# EAGLE design caretaker-dimmer-mini (EAGLE 5.10)
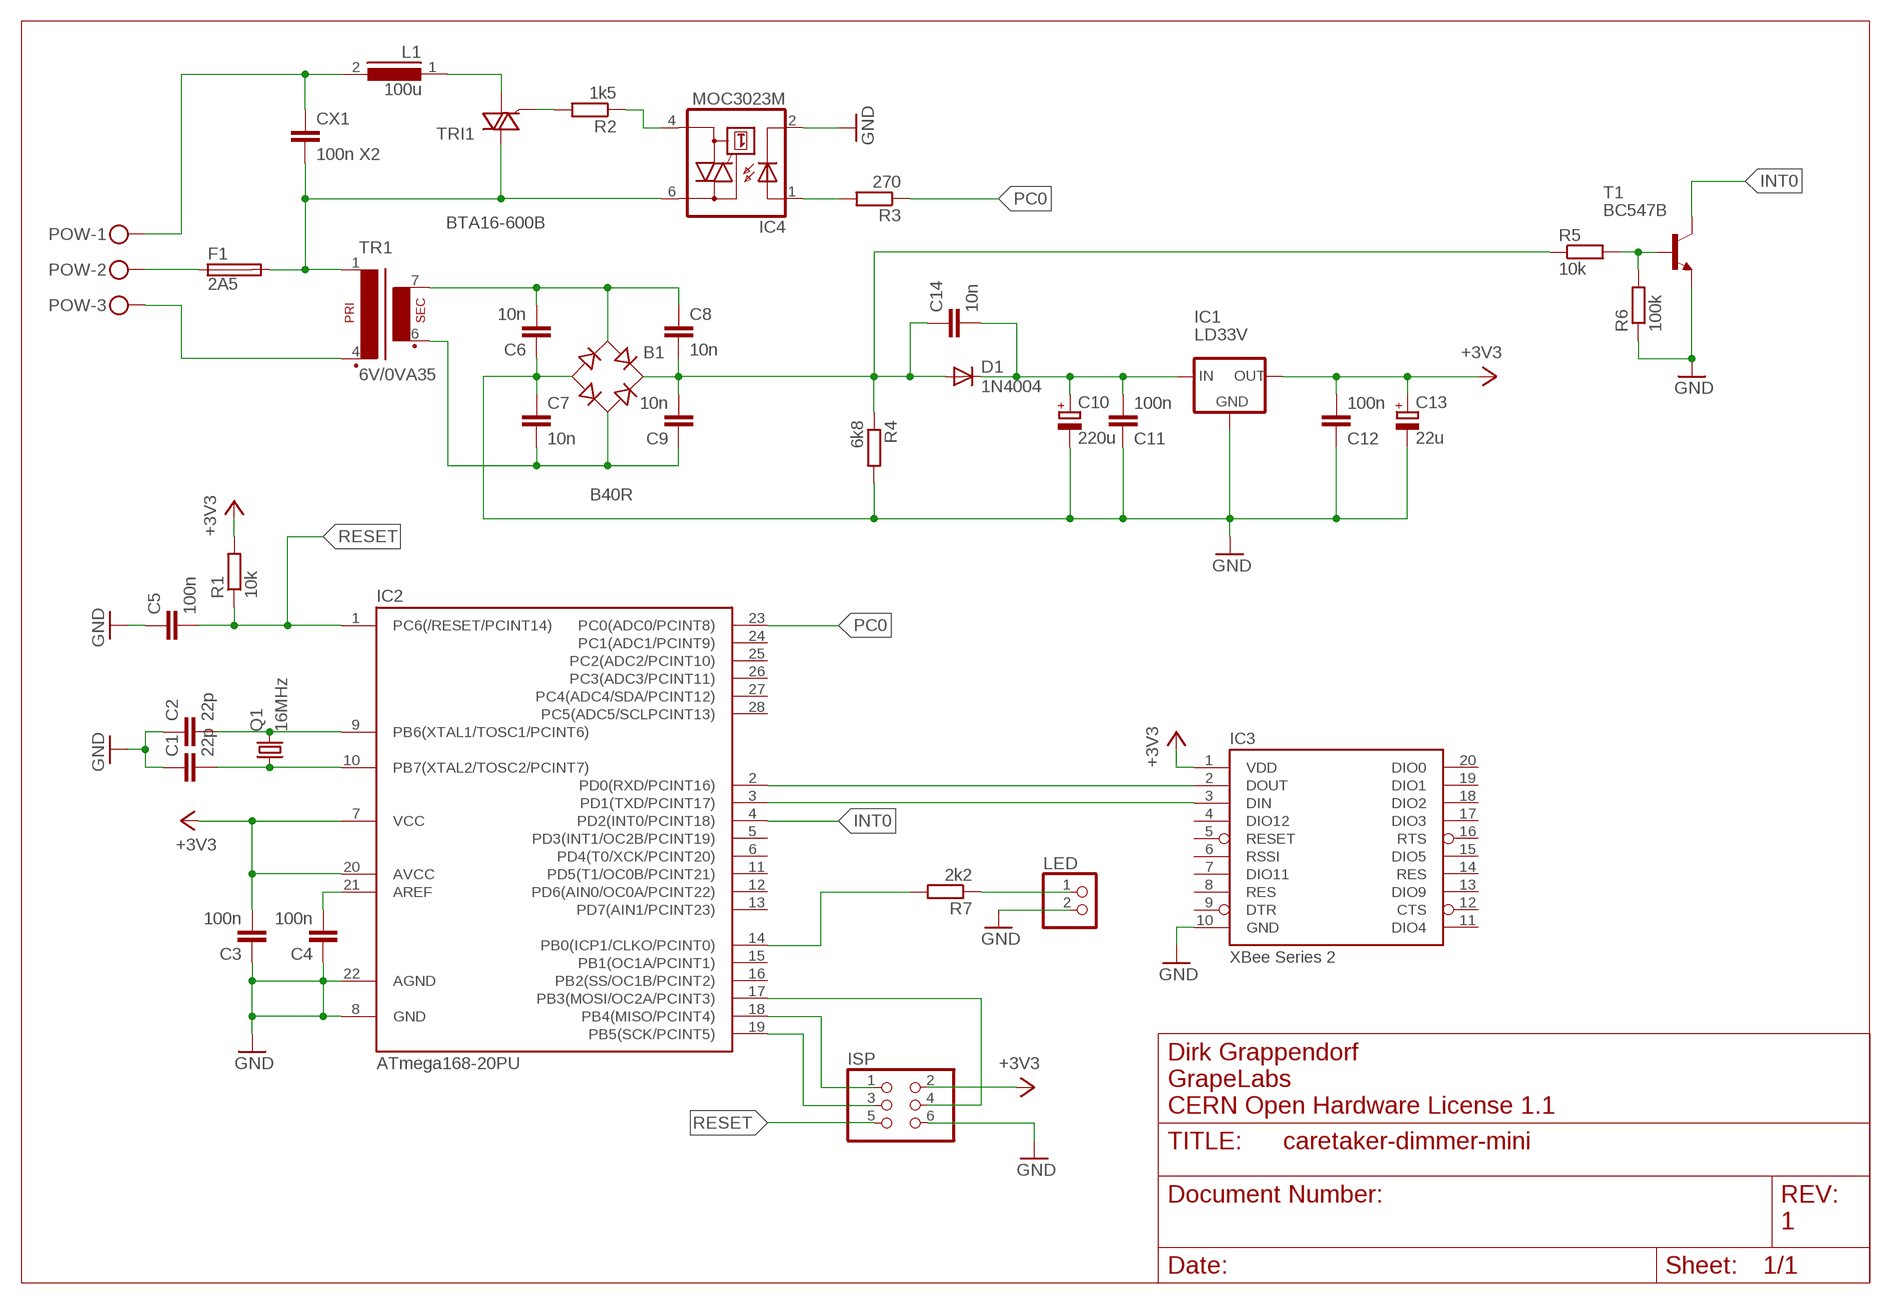
[diagram p0: schematic, sheet 1]

## Parts
B1  B40R  RECTIFIER-RB1A  [RB1A]
C1  22p  C-EU025-025X050  [C025-025X050]
C2  22p  C-EU025-025X050  [C025-025X050]
C3  100n  C-EU025-024X044  [C025-024X044]
C4  100n  C-EU025-024X044  [C025-024X044]
C5  100n  C-EU025-024X044  [C025-024X044]
C6  10n  C-EU025-024X044  [C025-024X044]
C7  10n  C-EU025-024X044  [C025-024X044]
C8  10n  C-EU025-024X044  [C025-024X044]
C9  10n  C-EU025-024X044  [C025-024X044]
C10  220u  CPOL-EUE3.5-8  [E3,5-8]
C11  100n  C-EU025-024X044  [C025-024X044]
C12  100n  C-EU025-024X044  [C025-024X044]
C13  22u  CPOL-EUE2.5-5  [E2,5-5]
C14  10n  C-EU025-024X044  [C025-024X044]
CX1  100n X2  CXXC15B10  [XC15B10]
D1  1N4004  DIODE-C1702-05  [C1702-05]
F1  2A5  SH22,5  [SH22,5]
IC1  LD33V  V_REG_LD1117VXX  [78XXL]
IC2  ATmega168-20PU  ATMEGA48/88/168-PU  [DIL28-3]
IC3  XBee Series 2  XBEE-1B1  [XBEE-1]
IC4  MOC3023M  [DIL06]
ISP  PINHD-2X3  [2X03]
L1  100u  ED22  [ED22]
LED  PINHD-1X2  [1X02]
POW  MKDSN1,5/3-5,08  [MKDSN1,5/3-5,08]
Q1  16MHz  CRYSTALHC49U-V  [HC49U-V]
R1  10k  R-EU_0204/7  [0204/7]
R2  1k5  R-EU_0204/7  [0204/7]
R3  270  R-EU_0207/2V  [0207/2V]
R4  6k8  R-EU_0207/2V  [0207/2V]
R5  10k  R-EU_0207/2V  [0207/2V]
R6  100k  R-EU_0207/2V  [0207/2V]
R7  2k2  R-EU_0207/2V  [0207/2V]
T1  BC547B  [TO92]
TR1  6V/0VA35  TRAFO-6V  [TRAFO-6V]
TRI1  BTA16-600B  BT136  [TO220AB]

## Nets
+3V3: C3.2 C12.2 C13.+ IC1.GND(OUT) IC2.7(VCC) IC2.20(AVCC) IC3.1(VDD) ISP.2 R1.2
GND: B1.- C1.1 C2.1 C3.1 C4.1 C5.1 C6.1 C7.1 C10.- C11.1 C12.1 C13.- IC1.IN(GND) IC2.8(GND) IC2.22(AGND) IC3.10(GND) IC4.2(C) ISP.6 LED.2 R4.2 R6.1 T1.1(E)
INT0: IC2.4(PD2(INT0/PCINT18)) T1.3(C)
N$1: C2.2 IC2.9(PB6(XTAL1/TOSC1/PCINT6)) Q1.2
N$2: C1.2 IC2.10(PB7(XTAL2/TOSC2/PCINT7)) Q1.1
N$3: C4.2 IC2.21(AREF)
N$4: LED.1 R7.1
N$5: B1.AC1 C6.2 C8.1 TR1.7(S4)
N$6: R2.2 TRI1.3(G)
N$7: C10.+ C11.2 C14.2 D1.C IC1.OUT(IN)
N$8: B1.AC2 C7.2 C9.1 TR1.6(S3)
N$9: CX1.1 L1.2 POW.1
N$10: F1.1 POW.2
N$11: L1.1 TRI1.1(A1)
N$12: CX1.2 F1.2 IC4.6(A2) TR1.1 TRI1.2(A2)
N$13: POW.3 TR1.4(P2)
N$14: IC4.4(A1) R2.1
N$15: IC4.1(A) R3.2
N$16: IC2.2(PD0(RXD/PCINT16)) IC3.2(DOUT)
N$17: IC2.3(PD1(TXD/PCINT17)) IC3.3(DIN)
N$18: B1.+ C8.2 C9.2 C14.1 D1.A R4.1 R5.1
N$19: R5.2 R6.2 T1.2(B)
N$20: IC2.18(PB4(MISO/PCINT4)) ISP.1
N$21: IC2.19(PB5(SCK/PCINT5)) ISP.3
N$22: IC2.17(PB3(MOSI/OC2A/PCINT3)) ISP.4
N$23: IC2.14(PB0(ICP1/CLKO/PCINT0)) R7.2
PC0: IC2.23(PC0(ADC0/PCINT8)) R3.1
RESET: C5.2 IC2.1(PC6(/RESET/PCINT14)) ISP.5 R1.1
Unconnected: IC2.5(PD3(INT1/OC2B/PCINT19)) IC2.6(PD4(T0/XCK/PCINT20)) IC2.11(PD5(T1/OC0B/PCINT21)) IC2.12(PD6(AIN0/OC0A/PCINT22)) IC2.13(PD7(AIN1/PCINT23)) IC2.15(PB1(OC1A/PCINT1)) IC2.16(PB2(SS/OC1B/PCINT2)) IC2.24(PC1(ADC1/PCINT9)) IC2.25(PC2(ADC2/PCINT10)) IC2.26(PC3(ADC3/PCINT11)) IC2.27(PC4(ADC4/SDA/PCINT12)) IC2.28(PC5(ADC5/SCLPCINT13)) IC3.4(DIO12) IC3.5(RESET) IC3.6(RSSI) IC3.7(DIO11) IC3.8(RES) IC3.9(DTR) IC3.11(DIO4) IC3.12(CTS) IC3.13(DIO9) IC3.14(RES) IC3.15(DIO5) IC3.16(RTS) IC3.17(DIO3) IC3.18(DIO2) IC3.19(DIO1) IC3.20(DIO0)

## Notes on the sheet
- Dirk Grappendorf
- GrapeLabs
- CERN Open Hardware License 1.1
- 1

## Library data of the parts
B1 = rectifier:RECTIFIER-: Rectifier
C1-C9 C11 C12 C14 = rcl:C-EU: CAPACITOR, European symbol
C10 C13 = rcl:CPOL-EU: POLARIZED CAPACITOR, European symbol
CX1 = rcl:CX: X CAPACITOR for power line
D1 = diode:DIODE-: DIODE
F1 = fuse:SH22,5: FUSE HOLDER grid 22,5 mm, OGN0031 8201, Schurter (Buerklin)
IC1 = SparkFun:V_REG_LD1117VXX: LD1117VXX voltage regulator. We carry the 3.3V version (COM-00526) in TO-220 package.
IC2 = atmega8:ATMEGA48/88/168-PU
IC3 = SparkFun:XBEE-1
IC4 = optocoupler:MOC30*M: RANDOM-PHASE OPTOISOLATORS TRIAC DRIVER OUTPUT Source: http://www.fairchildsemi.com MOC3020-M.pdf
ISP = pinhead:PINHD-2X3: PIN HEADER
L1 = inductors:ED22: INDUCTOR
LED = pinhead:PINHD-1X2: PIN HEADER
POW = con-phoenix-508:MKDSN1,5/3-5,08: MKDSN 1,5/ 3-5,08 Printklemme Nennstrom: 13,5 A Nennspannung: 250 V Rastermaß: 5,08 mm Polzahl: 3 Anschlussart: Schraubanschluss Montage: Löten Anschlussrichtung Leiter/Platine: 0 ° Artikelnummer: 1729131 Source: http://eshop.phoenixcontact.com .. 1729131.pdf
Q1 = crystal:CRYSTAL: CRYSTAL
R1-R7 = rcl:R-EU_: RESISTOR, European symbol
T1 = transistor-npn:BC547*: NPN Transistor
TR1 = grapelabs:TRAFO-6V: TRANSFORMER 1 primary winding, 1 secondary winding BLOCK
TRI1 = triac:BT136: Triac BT136 series E sensitive gate Source: http://www.nxp.com/acrobat_download/datasheets/BT136_SERIES_E_2.pdf

## Board
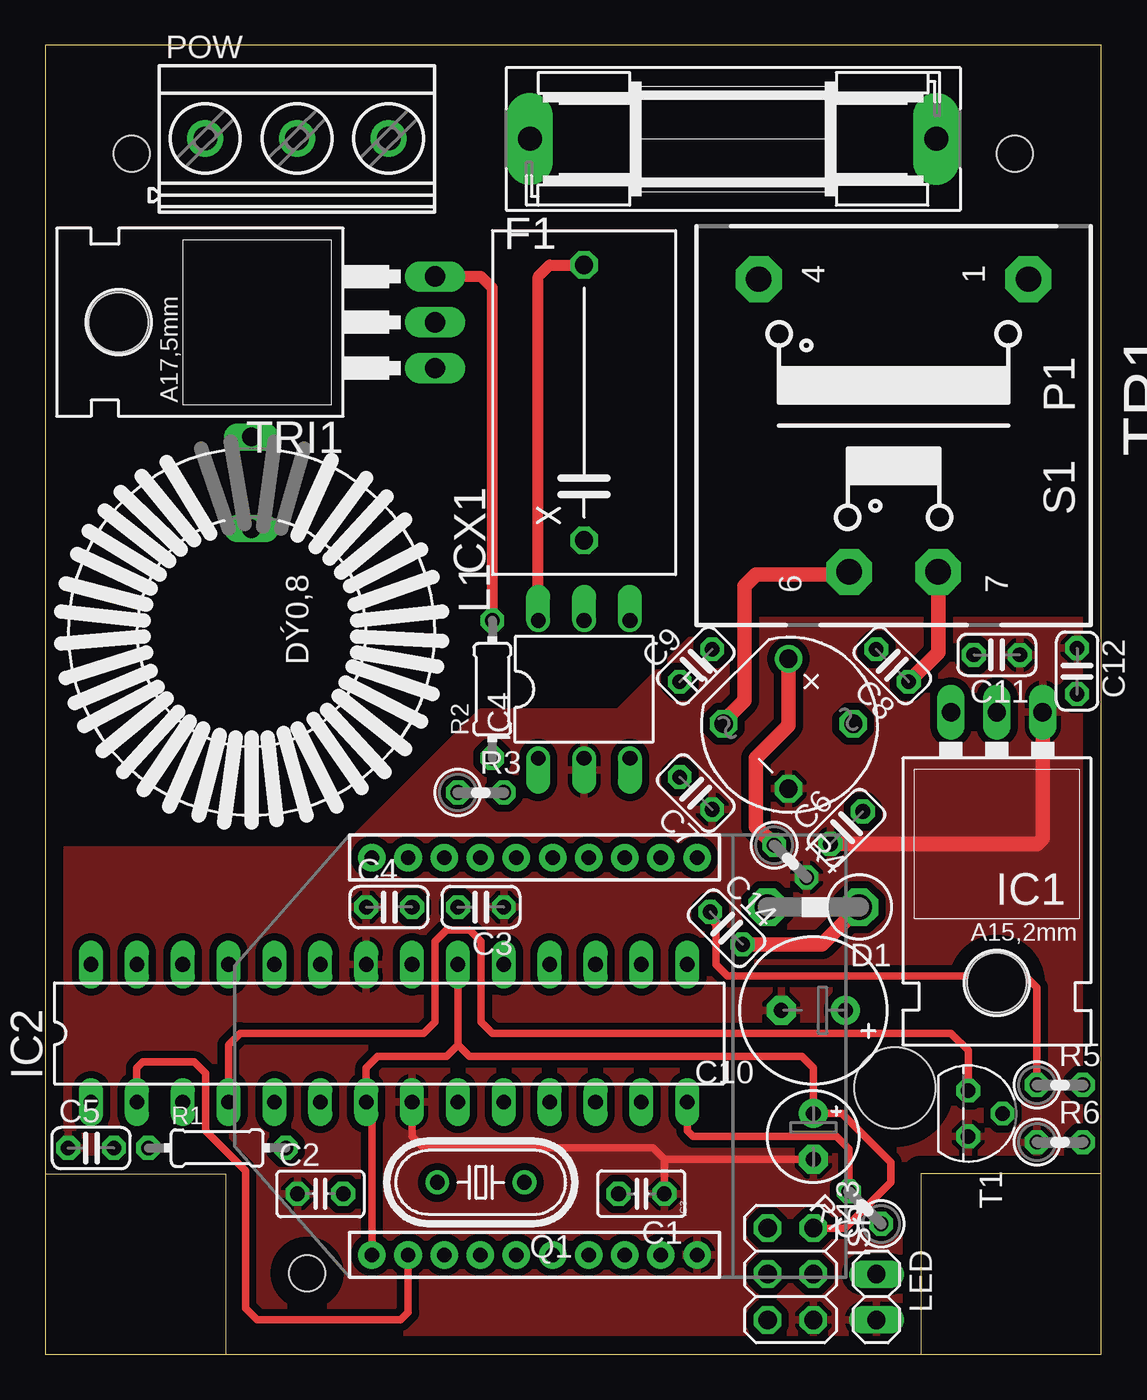
[diagram p1: board, top side]
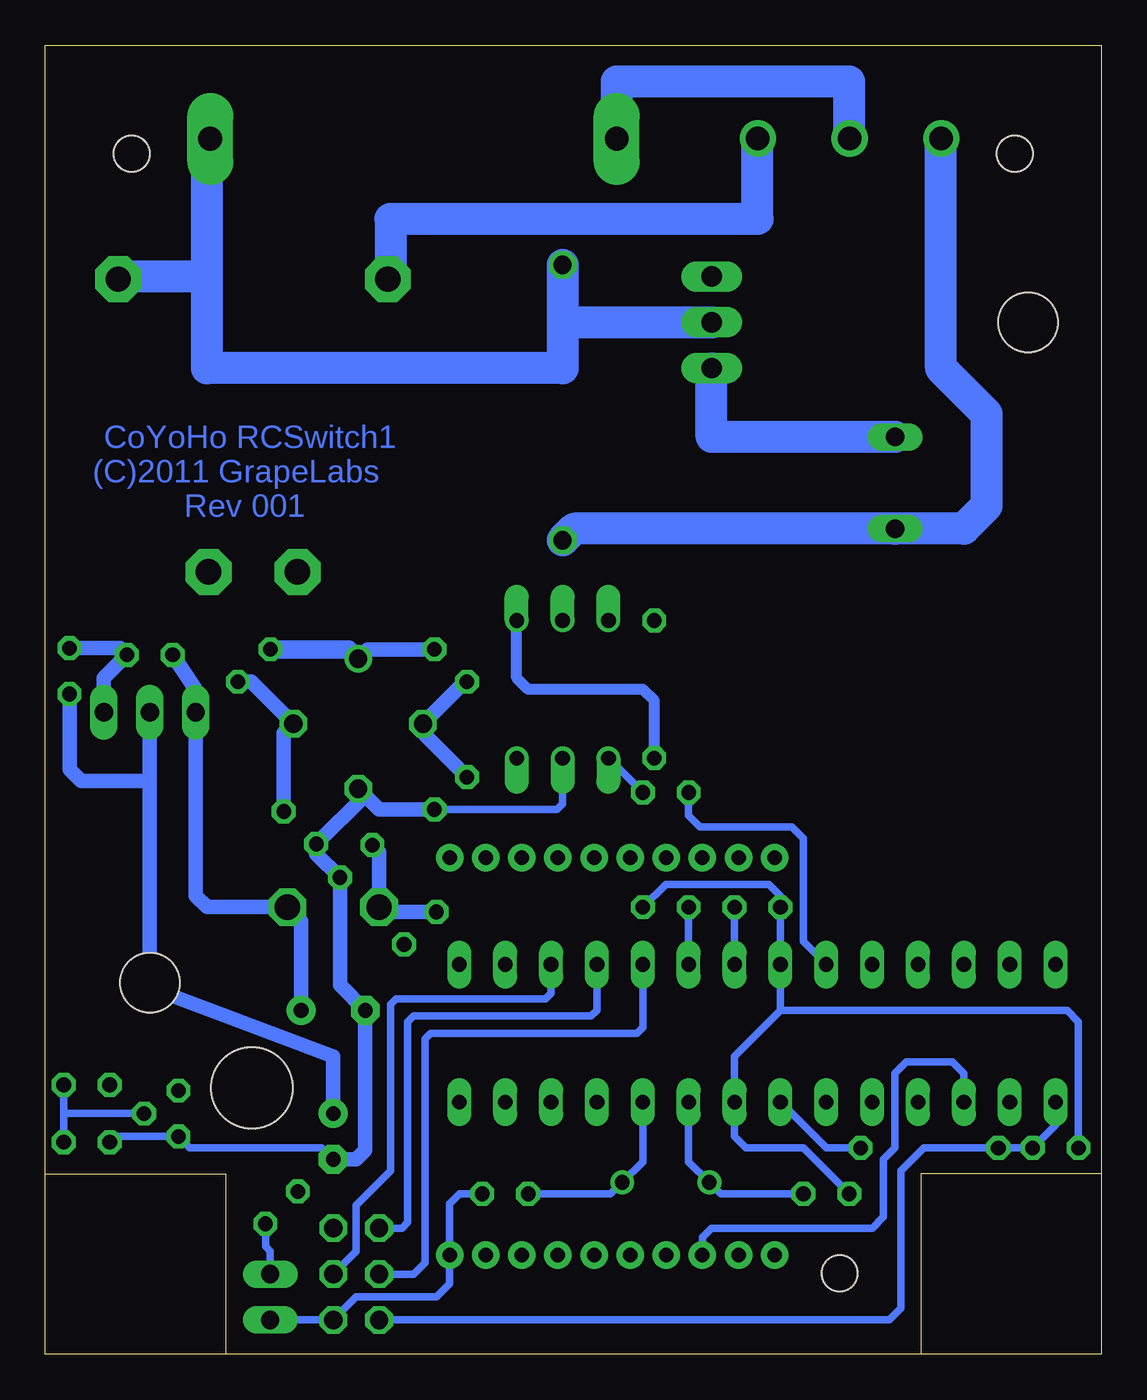
[diagram p2: board, bottom side, seen from below]

Size 58.5 x 72.5 mm. Coordinates in mm from the lower left corner, seen from the top.
Outline: 10,0 0,0 0,10
Outline: 10,0 48.5,0
Outline: 48.5,0 58.5,0 58.5,10
Outline: 58.5,10 58.5,72.5 0,72.5 0,10
Outline: 0,10 10,10 10,0
Outline: 58.5,10 48.5,10 48.5,0
Copper layers (1*16): Top 0.035mm / dielectric 1.5mm / Bottom 0.035mm
Design rules "default": minimum track width 10mil, minimum drill 24mil, track to track 8mil, track to pad 8mil, pad to pad 8mil, via to via 8mil, smd to smd 8mil, copper to edge 40mil, drill to drill 8mil, minimum pad ring 10mil, minimum via ring 8mil, stop-mask expansion 4mil, vias tented up to drill 0mil, thermal gap 10mil
Holes 2 mm at 4.8,66.5 53.7,66.5 14.5,4.5
Holes 4.5 mm at 47.05,14.75

### Footprints (pad centres in the part's own frame; a part is rotated, then mirrored left to right if it is on the bottom)
RB1A = drill 1.016 round: + -2.54,2.54 | drill 1.016 octagon: - 2.54,-2.54; AC1 2.54,2.54; AC2 -2.54,-2.54
C025-025X050 = drill 0.813 octagon: 1 -1.27,0; 2 1.27,0
C025-024X044 = drill 0.813 octagon: 1 -1.27,0; 2 1.27,0
E3,5-8 = drill 0.813 pad 1.6 round: + -1.778,0 | drill 0.813 pad 1.6 octagon: - 1.778,0
E2,5-5 = drill 0.813 pad 1.6 round: + -1.27,0 | drill 0.813 pad 1.6 octagon: - 1.27,0
XC15B10 = drill 1.016 octagon: 1 -7.62,0; 2 7.62,0
C1702-05 = drill 1.397 octagon: A 2.54,0; C -2.54,0
SH22,5 = drill 1.321 pad 2.54 long: 1 -11.252,0; 2 11.252,0
78XXL = drill 1.016 long: GND 0,-3.81; IN -2.54,-3.81; OUT 2.54,-3.81 | hole 3.302: 0,11.176
DIL28-3 = drill 0.813 long: 1 -16.51,-3.81; 2 -13.97,-3.81; 3 -11.43,-3.81; 4 -8.89,-3.81; 5 -6.35,-3.81; 6 -3.81,-3.81; 7 -1.27,-3.81; 8 1.27,-3.81; 9 3.81,-3.81; 10 6.35,-3.81; 11 8.89,-3.81; 12 11.43,-3.81; 13 13.97,-3.81; 14 16.51,-3.81; 15 16.51,3.81; 16 13.97,3.81; 17 11.43,3.81; 18 8.89,3.81; 19 6.35,3.81; 20 3.81,3.81; 21 1.27,3.81; 22 -1.27,3.81; 23 -3.81,3.81; 24 -6.35,3.81; 25 -8.89,3.81; 26 -11.43,3.81; 27 -13.97,3.81; 28 -16.51,3.81
XBEE-1 = drill 0.8 pad 1.524 round: 1 -11,20; 2 -11,18; 3 -11,16; 4 -11,14; 5 -11,12; 6 -11,10; 7 -11,8; 8 -11,6; 9 -11,4; 10 -11,2; 11 11,2; 12 11,4; 13 11,6; 14 11,8; 15 11,10; 16 11,12; 17 11,14; 18 11,16; 19 11,18; 20 11,20
DIL06 = drill 0.813 offset: 1 -2.54,-3.81; 2 0,-3.81; 3 2.54,-3.81; 4 2.54,3.81; 5 0,3.81; 6 -2.54,3.81
2X03 = drill 1.016 octagon: 1 -2.54,-1.27; 2 -2.54,1.27; 3 0,-1.27; 4 0,1.27; 5 2.54,-1.27; 6 2.54,1.27
ED22 = drill 1.016 long: 1 -10.795,0; 2 -5.715,0
1X02 = drill 1.016 long: 1 -1.27,0; 2 1.27,0
MKDSN1,5/3-5,08 = drill 1.3 pad 2 round: 1 -7.641,0.025; 2 -2.561,0.025; 3 2.519,0.025
HC49U-V = drill 0.813 round: 1 -2.413,0; 2 2.413,0
0204/7 = drill 0.813 octagon: 1 -3.81,0; 2 3.81,0
0207/2V = drill 0.813 octagon: 1 -1.27,0; 2 1.27,0
TO92 = drill 0.813 octagon: 1 1.27,0; 2 0,1.905; 3 -1.27,0
TRAFO-6V = drill 1.397 pad 2.54 octagon: 1 -8.103,7.468; 4 -8.103,-7.468; 6 8.103,-2.464; 7 8.103,2.464
TO220AB = drill 1.118 long: 1 -2.54,-6.35; 2 0,-6.35; 3 2.54,-6.35 | hole 3.302: 0,11.176

### Placement (x,y rotation side)
B1  41.17,34.92 315 top
C1  33.02,8.89 180 top
C2  15.24,8.89 0 top
C3  24.13,24.77 180 top
C4  19.05,24.77 0 top
C5  2.54,11.43 0 top
C6  44.39,29.16 45 top
C7  36.04,31.07 135 top
C8  46.93,38.15 135 top
C9  36.04,38.15 45 top
C10  42.55,19.05 180 top
C11  52.7,38.73 180 top
C12  57.15,37.84 270 top
C13  42.55,12.06 270 top
C14  37.73,23.6 315 top
CX1  29.84,52.7 90 top
D1  42.55,24.77 180 top
F1  38.1,67.31 0 top
IC1  52.7,31.75 180 top
IC2  19.05,17.78 0 top
IC3  38.1,16.51 90 top
IC4  29.84,36.83 0 top
ISP  41.27,4.45 270 top
L1  11.43,40.01 270 top
LED  46.04,3.17 270 top
POW  16.51,67.31 0 top
Q1  24.13,9.53 180 top
R1  9.53,11.43 0 top
R2  24.77,36.83 90 top
R3  24.13,31.11 0 top
R4  41.27,27.3 315 top
R5  56.2,14.92 0 top
R6  56.2,11.75 0 top
R7  45.4,8.12 135 top
T1  51.12,13.34 270 top
TR1  46.99,51.44 270 top
TRI1  15.24,57.15 90 top

### Tracks (layer width: path | path; a pad name or v marks a point on that pad's centre or on a via)
+3V3
  Top 0.406: 22.86,17.14 IC2.20 | 22.86,17.14 23.5,16.51 41.91,16.51 42.55,15.88 C13.+ 44.13,13.34 46.83,10.64 46.83,9.53 44.29,6.99 ISP.2 | 22.86,17.14 22.23,16.51 18.41,16.51 17.78,15.88 IC2.7 18.1,13.65 IC3.1
  Bottom 0.406: R1.2 15.24,11.43 IC2.7 | IC2.20 C3.2
  Bottom 0.813: C13.+ 42.55,16.51 52.7,20.32 52.7,31.75 | 52.7,31.75 IC1.GND | C12.2 57.15,32.38 56.52,31.75 52.7,31.75
GND
  Top 0.406: 34.29,10.79 C1.1 | IC2.8 20.32,12.06 20.95,11.43 33.66,11.43 34.29,10.79 | 34.29,10.79 C13.-
  Top 0.813: C6.1 54.94,28.27 55.24,28.57 IC1.IN
  Bottom 0.406: C2.1 16.51,11.43 19.68,11.43 20.32,12.06 IC2.8 20.32,16.51 17.78,19.05 | 17.78,19.05 IC2.22 C4.1 17.78,25.4 18.41,26.04 24.13,26.04 C3.1 | C5.1 1.27,18.41 1.91,19.05 17.78,19.05 | C1.1 35.56,8.89 36.1,8.35 IC3.10 36.1,3.9 36.83,3.17 41.27,3.17 ISP.6 LED.2 | R6.1 54.61,12.06 T1.1 50.48,11.43 43.18,11.43 C13.- | C7.1 30.15,30.17 29.84,30.48 IC4.2
  Bottom 0.813: C7.1 40.01,30.17 40.79,30.96 | 40.79,30.96 B1.- | C6.1 | C6.1 40.79,30.96 | IC1.IN 55.24,37.47 C11.1 54.35,39.11 C12.1 | C6.1 43.49,27.72 R4.2 42.17,20.46 C10.- 40.77,11.3 41.27,10.79 C13.-
  pour Top (isolate 0.406): 24.13,35.56 16.51,27.94 -3.27,27.94 -3.27,-3.27 61.69,-3.27 61.69,40.64 36.83,40.64 31.75,35.56
INT0
  Top 0.406: T1.3 51.12,16.83 50.16,17.78 24.77,17.78 24.13,18.41 24.13,22.86 23.5,23.5 22.23,23.5 21.59,22.86 21.59,18.41 20.95,17.78 10.79,17.78 10.16,17.14 IC2.4
N$1
  Bottom 0.406: IC2.9 22.86,10.67 Q1.2 21.08,8.89 C2.2
N$2
  Bottom 0.406: IC2.10 25.4,10.67 Q1.1 27.18,8.89 C1.2
N$3
  Bottom 0.406: IC2.21 C4.2
N$4
  Bottom 0.406: R7.1 46.3,5.98 46.04,5.71 LED.1
N$5
  Top 0.813: TR1.7 49.45,38.88 C8.1
  Bottom 0.813: C6.2 45.28,34.4 B1.AC1 47.08,37.25 C8.1
N$6
  Top 0.61: R2.2 24.77,59.05 24.13,59.69 TRI1.3
N$7
  Top 0.813: C14.2 43.03,22.71 D1.C
  Bottom 0.813: C11.2 50.16,36.83 IC1.OUT 50.16,25.4 49.53,24.77 D1.C 44.32,24 C10.+
N$8
  Top 0.813: B1.AC2 37.57,35.03 38.73,36.2 38.73,42.55 39.37,43.18 44.37,43.18 TR1.6
  Bottom 0.813: C9.1 35.25,37.25 B1.AC2 37.47,34.82 37.47,34.29 C7.2 | C7.2
N$9
  Bottom 1.778: CX1.1 29.21,45.72 L1.2 7.62,45.72 6.35,46.99 6.35,52.07 8.89,54.61 8.89,67.31 POW.1
N$10
  Bottom 1.778: POW.2 13.97,67.33 13.97,70.48 26.85,70.48 F1.1
N$11
  Bottom 1.778: TRI1.1 21.59,50.8 L1.1
N$12
  Top 0.61: IC4.6 27.3,59.69 27.94,60.33 CX1.2
  Bottom 1.778: F1.2 49.53,67.31 49.53,59.69 | 49.53,59.69 54.46,59.69 TR1.1 | CX1.2 29.84,57.15 | 29.84,57.15 TRI1.2 | 49.53,59.69 49.53,54.61 29.84,54.61 29.84,57.15
N$13
  Bottom 1.778: POW.3 19.05,67.33 19.05,62.87 39.37,62.87 39.37,59.69 39.52,59.69 TR1.4
N$14
  Bottom 0.61: R2.1 24.77,36.2 25.4,36.83 31.75,36.83 32.38,37.47 IC4.4
N$15
  Bottom 0.406: R3.2 IC4.1
N$16
  Top 0.406: IC2.2 5.08,15.88 5.4,16.19 8.26,16.19 8.89,15.56 8.89,12.38 11.11,10.16 11.11,2.54 11.75,1.91 19.68,1.91 20.1,2.32 IC3.2
N$17
  Bottom 0.406: IC2.3 7.62,15.56 8.26,16.19 10.79,16.19 11.43,15.56 11.43,11.43 12.06,10.79 12.06,7.62 12.7,6.99 21.59,6.99 22.1,6.47 IC3.3
N$18
  Top 0.406: R5.1 54.93,20.32 54.29,20.95 37.78,20.95 37.15,21.59 37.15,23.81 36.83,24.13 C14.1 | C14.1
  Top 0.813: B1.+ 41.17,34.82 39.37,33.02 39.37,29.21 R4.1
  Bottom 0.813: C9.2 40.64,39.04 B1.+ 41.69,39.04 | R4.1 40.01,27.83 D1.A 39.74,24.5 C14.1
  Bottom 1.016: 41.69,39.04 C8.2
N$19
  Bottom 0.406: 57.47,13.34 R6.2 | 57.47,13.34 R5.2 | T1.2 57.47,13.34
N$20
  Bottom 0.406: IC2.18 27.94,19.05 28.26,18.73 38.1,18.73 38.42,18.41 38.42,7.3 38.73,6.99 ISP.1
N$21
  Bottom 0.406: IC2.19 25.4,18.1 25.72,17.78 37.15,17.78 37.47,17.46 37.47,5.08 38.1,4.45 ISP.3
N$22
  Bottom 0.406: IC2.17 30.48,20 30.8,19.68 39.05,19.68 39.37,19.37 39.37,10.16 41.27,8.26 41.27,5.71 ISP.4
N$23
  Top 0.406: IC2.14 35.56,12.38 35.88,12.06 43.81,12.06 44.5,11.38 R7.2
N$24  (via drill 0.6 pad 2)
  other vias: 4.8,66.5
N$25  (via drill 0.6 pad 2)
  other vias: 53.7,66.5
N$26  (via drill 0.6 pad 2)
  other vias: 14.5,4.5
N$27  (via drill 0.6 pad 4.5)
  other vias: 47.05,14.75
PC0
  Bottom 0.406: R3.1 22.86,29.84 22.23,29.21 17.14,29.21 16.51,28.57 16.51,22.86 IC2.23
RESET
  Bottom 0.406: IC2.1 2.54,12.7 C5.2 R1.1 9.84,11.43 11.11,10.16 11.11,2.54 11.75,1.91 ISP.5

### Text on the board
Bottom: CoYoHo RCSwitch1 | (C)2011 GrapeLabs | Rev 001